# EAGLE design eTapper1main23 (EAGLE 8.2.2)
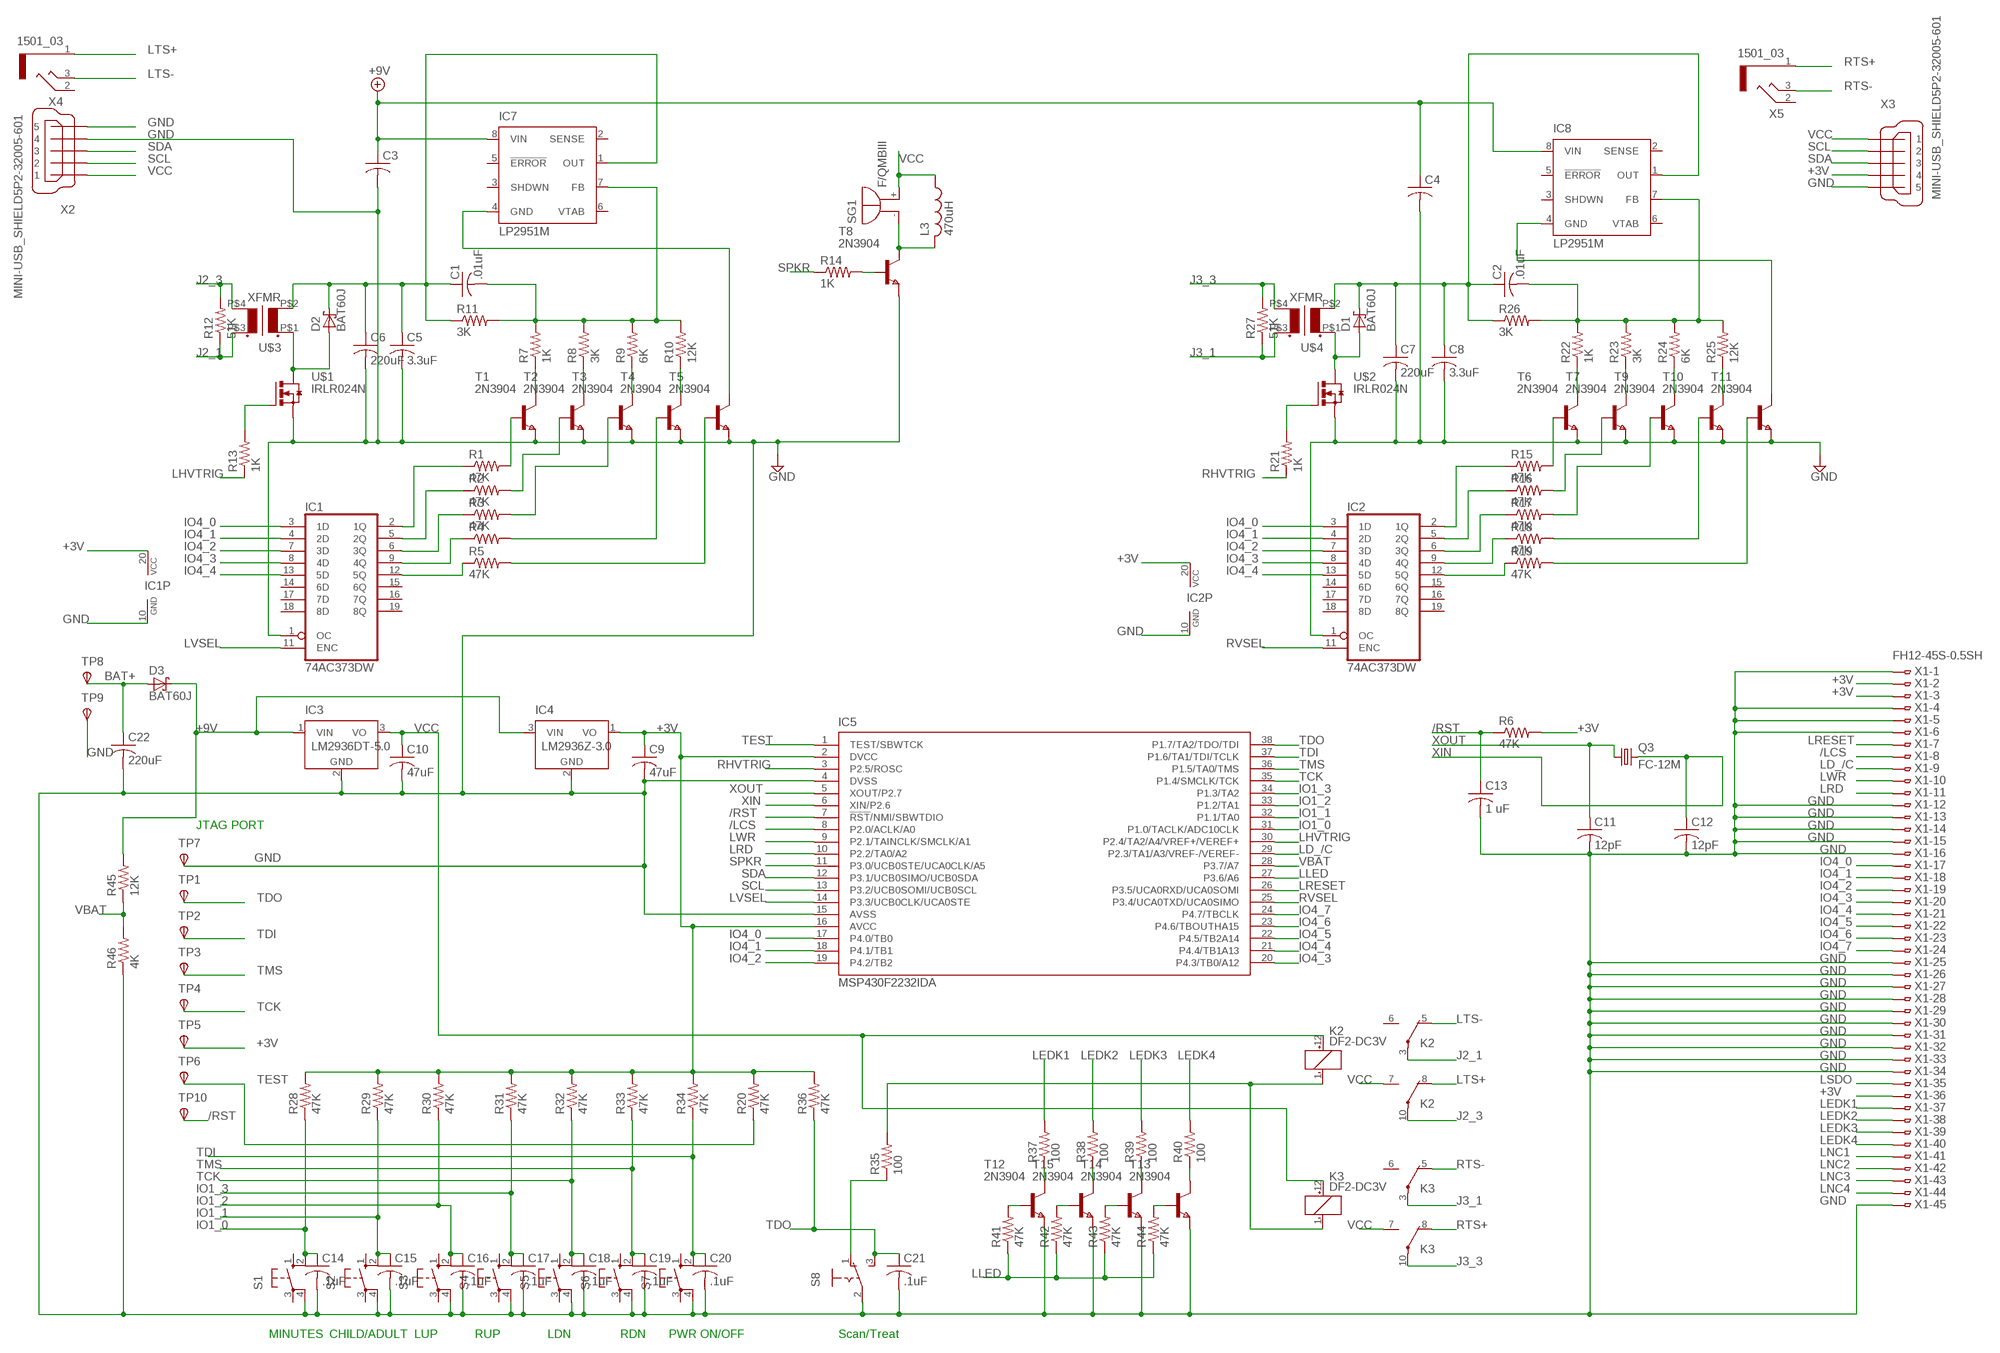
[diagram p0: schematic, sheet 1]

## Parts
C1  .01uF  C-USC0805  [C0805]
C2  .01uF  C-USC0805  [C0805]
C3  C-USC0805  [C0805]
C4  C-USC0805  [C0805]
C5  3.3uF  C-USC0805  [C0805]
C6  220uF  C-USC0805  [C0805]
C7  220uF  C-USC0805  [C0805]
C8  3.3uF  C-USC0805  [C0805]
C9  47uF  C-USC0805  [C0805]
C10  47uF  C-USC0805  [C0805]
C11  12pF  C-USC0805  [C0805]
C12  12pF  C-USC0805  [C0805]
C13  1 uF  C-USC0805  [C0805]
C14  .1uF  C-USC0805  [C0805]
C15  .1uF  C-USC0805  [C0805]
C16  .1uF  C-USC0805  [C0805]
C17  .1uF  C-USC0805  [C0805]
C18  .1uF  C-USC0805  [C0805]
C19  .1uF  C-USC0805  [C0805]
C20  .1uF  C-USC0805  [C0805]
C21  .1uF  C-USC0805  [C0805]
C22  220uF  C-USC0805  [C0805]
D1  BAT60J  [SOD323_ST]
D2  BAT60J  [SOD323_ST]
D3  BAT60J  [SOD323_ST]
IC1  74AC373DW  [SO20W]
IC2  74AC373DW  [SO20W]
IC3  LM2936DT-5.0  [TO252]
IC4  LM2936Z-3.0  [TO92]
IC5  MSP430F2232IDA  [TSSOP38_R-PDSO-G38-DA]
IC7  LP2951M  [SO08]
IC8  LP2951M  [SO08]
K2  DF2-DC3V  [DF2]
K3  DF2-DC3V  [DF2]
L3  470uH  L-USL2825P  [L2825P]
Q3  FC-12M  [FC-12M]
R1  47K  R-US_R0402  [R0402]
R2  47K  R-US_R0402  [R0402]
R3  47K  R-US_R0402  [R0402]
R4  R-US_R0402  [R0402]
R5  47K  R-US_R0402  [R0402]
R6  47K  R-US_R0402  [R0402]
R7  1K  R-US_R0402  [R0402]
R8  3K  R-US_R0402  [R0402]
R9  6K  R-US_R0402  [R0402]
R10  12K  R-US_R0402  [R0402]
R11  3K  R-US_R0402  [R0402]
R12  51K  R-US_R0402  [R0402]
R13  1K  R-US_R0402  [R0402]
R14  1K  R-US_R0402  [R0402]
R15  47K  R-US_R0402  [R0402]
R16  47K  R-US_R0402  [R0402]
R17  47K  R-US_R0402  [R0402]
R18  47K  R-US_R0402  [R0402]
R19  47K  R-US_R0402  [R0402]
R20  47K  R-US_R0402  [R0402]
R21  1K  R-US_R0402  [R0402]
R22  1K  R-US_R0402  [R0402]
R23  3K  R-US_R0402  [R0402]
R24  6K  R-US_R0402  [R0402]
R25  12K  R-US_R0402  [R0402]
R26  3K  R-US_R0402  [R0402]
R27  51K  R-US_R0402  [R0402]
R28  47K  R-US_R0402  [R0402]
R29  47K  R-US_R0402  [R0402]
R30  47K  R-US_R0402  [R0402]
R31  47K  R-US_R0402  [R0402]
R32  47K  R-US_R0402  [R0402]
R33  47K  R-US_R0402  [R0402]
R34  47K  R-US_R0402  [R0402]
R35  100  R-US_R0402  [R0402]
R36  47K  R-US_R0402  [R0402]
R37  100  R-US_R0402  [R0402]
R38  100  R-US_R0402  [R0402]
R39  100  R-US_R0402  [R0402]
R40  100  R-US_R0402  [R0402]
R41  47K  R-US_R0402  [R0402]
R42  47K  R-US_R0402  [R0402]
R43  47K  R-US_R0402  [R0402]
R44  47K  R-US_R0402  [R0402]
R45  12K  R-US_R0402  [R0402]
R46  4K  R-US_R0402  [R0402]
S1  10-XX  [B3F-10XX]
S2  10-XX  [B3F-10XX]
S3  10-XX  [B3F-10XX]
S4  10-XX  [B3F-10XX]
S5  10-XX  [B3F-10XX]
S6  10-XX  [B3F-10XX]
S7  10-XX  [B3F-10XX]
S8  M251  [M251]
SG1  F/QMBIII  [F/QMBIII]
T1  2N3904  NPNSOT23  [SOT-23]
T2  2N3904  NPNSOT23  [SOT-23]
T3  2N3904  NPNSOT23  [SOT-23]
T4  2N3904  NPNSOT23  [SOT-23]
T5  2N3904  NPNSOT23  [SOT-23]
T6  2N3904  NPNSOT23  [SOT-23]
T7  2N3904  NPNSOT23  [SOT-23]
T8  2N3904  NPNSOT23  [SOT-23]
T9  2N3904  NPNSOT23  [SOT-23]
T10  2N3904  NPNSOT23  [SOT-23]
T11  2N3904  NPNSOT23  [SOT-23]
T12  2N3904  NPNSOT23  [SOT-23]
T13  2N3904  NPNSOT23  [SOT-23]
T14  2N3904  NPNSOT23  [SOT-23]
T15  2N3904  NPNSOT23  [SOT-23]
TP1  TPSTP06R  [TP06R]
TP2  TPSTP06R  [TP06R]
TP3  TPSTP06R  [TP06R]
TP4  TPSTP06R  [TP06R]
TP5  TPSTP06R  [TP06R]
TP6  TPSTP06R  [TP06R]
TP7  TPSTP06R  [TP06R]
TP8  TPSTP06R  [TP06R]
TP9  TPSTP06R  [TP06R]
TP10  TPSTP06R  [TP06R]
U$1  IRLR024N  [D-PAK_TO252AA]
U$2  IRLR024N  [D-PAK_TO252AA]
U$3  XFMR  [XFMR]
U$4  XFMR  [XFMR]
X1  FH12-45S-0.5SH  [FH12-45S-0.5SH]
X2  MINI-USB_SHIELD5P2-32005-601  [32005-601]
X3  MINI-USB_SHIELD5P2-32005-601  [32005-601]
X4  1501_03  [1501_03]
X5  1501_03  [1501_03]

## Nets
+3V: C9.1 IC1.20(VCC) IC2.20(VCC) IC4.1(VO) IC5.2(DVCC) IC5.16(AVCC) R6.2 R20.2 R28.2 R29.2 R30.2 R31.2 R32.2 R33.2 R34.2 R36.2 TP5.TP(PP) X1.2 X1.3 X1.36 X3.4
+9V: C3.1 C4.1 D3.C IC3.1(VIN) IC4.3(VIN) IC7.8(VIN) IC8.8(VIN) R45.2
/LCS: IC5.8(P2.0/ACLK/A0) X1.8
/RST: C13.1 IC5.7(!RST!/NMI/SBWTDIO) R6.1 TP10.TP(PP)
BAT+: C22.1 D3.A TP8.TP(PP)
GND: C3.2 C4.2 C5.2 C6.2 C7.2 C8.2 C9.2 C10.2 C11.2 C12.2 C13.2 C14.2 C15.2 C16.2 C17.2 C18.2 C19.2 C20.2 C21.2 C22.2 IC1.1(OC) IC1.10(GND) IC2.1(OC) IC2.10(GND) IC3.2(GND) IC4.2(GND) IC5.4(DVSS) IC5.15(AVSS) R46.1 S1.4(P1) S2.4(P1) S3.4(P1) S4.4(P1) S5.4(P1) S6.4(P1) S7.4(P1) S8.2(P) T1.2(E) T2.2(E) T3.2(E) T4.2(E) T5.2(E) T6.2(E) T7.2(E) T8.2(E) T9.2(E) T10.2(E) T11.2(E) T12.2(E) T13.2(E) T14.2(E) T15.2(E) TP7.TP(PP) TP9.TP(PP) U$1.3(S) U$2.3(S) X1.1 X1.4 X1.5 X1.6 X1.12 X1.13 X1.14 X1.15 X1.16 X1.25 X1.26 X1.27 X1.28 X1.29 X1.30 X1.31 X1.32 X1.33 X1.34 X1.45 X2.4 X2.5 X3.5
IO1_0: C14.1 IC5.31(P1.0/TACLK/ADC10CLK) R28.1 S1.2(S1)
IO1_1: C15.1 IC5.32(P1.1/TA0) R29.1 S2.2(S1)
IO1_2: C16.1 IC5.33(P1.2/TA1) R30.1 S3.2(S1)
IO1_3: C17.1 IC5.34(P1.3/TA2) R31.1 S4.2(S1)
IO4_0: IC1.3(1D) IC2.3(1D) IC5.17(P4.0/TB0) X1.17
IO4_1: IC1.4(2D) IC2.4(2D) IC5.18(P4.1/TB1) X1.18
IO4_2: IC1.7(3D) IC2.7(3D) IC5.19(P4.2/TB2) X1.19
IO4_3: IC1.8(4D) IC2.8(4D) IC5.20(P4.3/TB0/A12) X1.20
IO4_4: IC1.13(5D) IC2.13(5D) IC5.21(P4.4/TB1A13) X1.21
IO4_5: IC5.22(P4.5/TB2A14) X1.22
IO4_6: IC5.23(P4.6/TBOUTHA15) X1.23
IO4_7: IC5.24(P4.7/TBCLK) X1.24
J2_1: K2.3(2:P) R12.1 U$3.P$3(S1)
J2_3: K2.10(3:P) R12.2 U$3.P$4(S2)
J3_1: K3.3(2:P) R27.1 U$4.P$3(S1)
J3_3: K3.10(3:P) R27.2 U$4.P$4(S2)
LD_/C: IC5.29(P2.3/TA1/A3/VREF-/VEREF-) X1.9
LEDK1: R37.2 X1.37
LEDK2: R38.2 X1.38
LEDK3: R39.2 X1.39
LEDK4: R40.2 X1.40
LHVTRIG: IC5.30(P2.4/TA2/A4/VREF+/VEREF+) R13.1
LLED: IC5.27(P3.6/A6) R41.1 R42.1 R43.1 R44.1
LNC1: X1.41
LNC2: X1.42
LNC3: X1.43
LNC4: X1.44
LRD: IC5.10(P2.2/TA0/A2) X1.11
LRESET: IC5.26(P3.5/UCA0RXD/UCA0SOMI) X1.7
LSDO: X1.35
LTS+: K2.8(3:O) X4.1
LTS-: K2.5(2:O) X4.3
LVSEL: IC1.11(ENC) IC5.14(P3.3/UCB0CLK/UCA0STE)
LWR: IC5.9(P2.1/TAINCLK/SMCLK/A1) X1.10
N$1: IC1.2(1Q) R1.1
N$2: IC1.5(2Q) R2.1
N$3: IC1.6(3Q) R3.1
N$4: IC1.9(4Q) R4.1
N$5: IC1.12(5Q) R5.1
N$6: L3.2 SG1.-(+) T8.1(C)
N$7: R4.2 T4.3(B)
N$8: R5.2 T5.3(B)
N$9: D2.A U$1.4(D) U$3.P$1(P1)
N$10: R7.1 T1.1(C)
N$11: R8.1 T2.1(C)
N$12: R9.1 T3.1(C)
N$13: R1.2 T1.3(B)
N$14: R2.2 T2.3(B)
N$15: R3.2 T3.3(B)
N$16: R10.1 T4.1(C)
N$17: C1.2 IC7.7(FB) R7.2 R8.2 R9.2 R10.2 R11.2
N$18: C1.1 C5.1 C6.1 D2.C IC7.1(OUT) R11.1 U$3.P$2(P2)
N$19: D1.A U$2.4(D) U$4.P$1(P1)
N$20: IC2.2(1Q) R15.1
N$21: R13.2 U$1.1(G)
N$22: R14.2 T8.3(B)
N$23: R35.1 S8.1(O)
N$24: IC2.5(2Q) R16.1
N$25: IC2.6(3Q) R17.1
N$26: IC2.9(4Q) R18.1
N$27: IC2.12(5Q) R19.1
N$28: R44.2 T13.3(B)
N$29: R15.2 T6.3(B)
N$30: R16.2 T7.3(B)
N$31: R17.2 T9.3(B)
N$32: R18.2 T10.3(B)
N$33: R19.2 T11.3(B)
N$34: K2.1(1:-) K3.1(1:-) R35.2
N$35: R22.1 T6.1(C)
N$36: R23.1 T7.1(C)
N$37: R24.1 T9.1(C)
N$38: R25.1 T10.1(C)
N$39: C2.2 IC8.7(FB) R22.2 R23.2 R24.2 R25.2 R26.2
N$40: C2.1 C7.1 C8.1 D1.C IC8.1(OUT) R26.1 U$4.P$2(P2)
N$41: R37.1 T12.1(C)
N$42: R21.2 U$2.1(G)
N$43: R38.1 T15.1(C)
N$44: R39.1 T14.1(C)
N$45: IC7.4(GND) T5.1(C)
N$46: R40.1 T13.1(C)
N$47: IC8.4(GND) T11.1(C)
N$48: R43.2 T14.3(B)
N$49: R41.2 T12.3(B)
N$50: R42.2 T15.3(B)
RHVTRIG: IC5.3(P2.5/ROSC) R21.1
RTS+: K3.8(3:O) X5.1
RTS-: K3.5(2:O) X5.3
RVSEL: IC2.11(ENC) IC5.25(P3.4/UCA0TXD/UCA0SIMO)
SCL: IC5.13(P3.2/UCB0SOMI/UCB0SCL) X2.2 X3.2
SDA: IC5.12(P3.1/UCB0SIMO/UCB0SDA) X2.3 X3.3
SPKR: IC5.11(P3.0/UCB0STE/UCA0CLK/A5) R14.1
TCK: C18.1 IC5.35(P1.4/SMCLK/TCK) R32.1 S5.2(S1) TP4.TP(PP)
TDI: C20.1 IC5.37(P1.6/TA1/TDI/TCLK) R34.1 S7.2(S1) TP2.TP(PP)
TDO: C21.1 IC5.38(P1.7/TA2/TDO/TDI) R36.1 S8.3(S) TP1.TP(PP)
TEST: IC5.1(TEST/SBWTCK) R20.1 TP6.TP(PP)
TMS: C19.1 IC5.36(P1.5/TA0/TMS) R33.1 S6.2(S1) TP3.TP(PP)
VBAT: IC5.28(P3.7/A7) R45.1 R46.2
VCC: C10.1 IC3.3(VO) K2.7(3:S) K2.12(1:+) K3.7(3:S) K3.12(1:+) L3.1 SG1.+(-) X2.1 X3.1
XIN: C12.1 IC5.6(XIN/P2.6) Q3.2
XOUT: C11.1 IC5.5(XOUT/P2.7) Q3.1
Unconnected: IC1.14(6D) IC1.15(6Q) IC1.16(7Q) IC1.17(7D) IC1.18(8D) IC1.19(8Q) IC2.14(6D) IC2.15(6Q) IC2.16(7Q) IC2.17(7D) IC2.18(8D) IC2.19(8Q) IC7.2(SENSE) IC7.3(SHDWN) IC7.5(!ERROR) IC7.6(VTAB) IC8.2(SENSE) IC8.3(SHDWN) IC8.5(!ERROR) IC8.6(VTAB) K2.6(2:S) K3.6(2:S) S1.1(S) S1.3(P) S2.1(S) S2.3(P) S3.1(S) S3.3(P) S4.1(S) S4.3(P) S5.1(S) S5.3(P) S6.1(S) S6.3(P) S7.1(S) S7.3(P) X2.M1(S1) X2.M2(S2) X3.M1(S1) X3.M2(S2) X4.2 X5.2

## Notes on the sheet
- JTAG PORT
- MINUTES | CHILD/ADULT | LUP | RUP | LDN | RDN | PWR ON/OFF | Scan/Treat

## Library data of the parts
C1-C22 = rcl:C-US: CAPACITOR, American symbol
D1-D3 = diode:BAT60J: Schottky barrier diode Source: www.st.com, BAT60J.pdf
IC1 IC2 = 74xx-eu:74*373: Octal D type transparent LATCH, edge triggered
IC3 = national-semiconductor:LM2936?*: Ultra-Low Quiescent Current LDO Voltage Regulator Source: Data sheet <http://www.national.com/ds/LM/LM2936.pdf>; MF: NATIONAL SEMICONDUCTOR; MPN: LM2936DT-5.0/NOPB; OC_FARNELL: 1286864; OC_NEWARK: 41K4501
IC4 = national-semiconductor:LM2936?*: Ultra-Low Quiescent Current LDO Voltage Regulator Source: Data sheet <http://www.national.com/ds/LM/LM2936.pdf>; MF: NATIONAL SEMICONDUCTOR; MPN: LM2936Z-3.0/NOPB; OC_FARNELL: 1312709; OC_NEWARK: 41K4531
IC5 = texas:MSP430F22*2IDA: MIXED SIGNAL MICROCONTROLLER Source: http://focus.ti.com/lit/ds/symlink/msp430f2274.pdf; MPN: MSP430F2232IDA; OC_FARNELL: 1610178; OC_NEWARK: 28M6312
IC7 IC8 = national-semiconductor:LP2951: Adjustable Micropower Voltage Regulator Source: http://www.national.com/ds/LP/LP2950.pdf; MF: FAIRCHILD SEMICONDUCTOR; MPN: LP2951CM; OC_FARNELL: 9488561; OC_NEWARK: 78K6014
K2 K3 = relay:DF2-?DC*: HIGHLY SENSITIVE DIP MINIATURE RELAY NAiS Single side stable / 1 coil latching Source: http://www.mew-europe.com/.. en_ds_61002_0000.pdf; OC_FARNELL: unknown; OC_NEWARK: unknown
L3 = rcl:L-US: INDUCTOR, American symbol
Q3 = crystal:FC-12M: kHz RANGE CRYSTAL UNIT LOW PROFILE SMD Source: Epson Toyocom FC-12M.pdf
R1-R46 = resistor:R-US_: RESISTOR, American symbol
S1-S7 = switch-omron:10-XX: OMRON SWITCH; MPN: B3F-1000; OC_FARNELL: 176432; OC_NEWARK: 36M3542
S8 = switch:M251: SLIDING SWITCH Mors, distributor Buerklin, 11G702
SG1 = buzzer:F/QMBIII: BUZZER Source: Buerklin; OC_FARNELL: unknown; OC_NEWARK: unknown
T1-T15 = zetex:NPNSOT23: NPN TRANSISTOR; MPN: DSS20201L-7; OC_FARNELL: 1710688; OC_NEWARK: 25R4555
TP1-TP10 = testpad:TPS: TEST PIN
U$1 U$2 = IRLR024N:IRLR024N: IRLR024N HEXFET Power Mosfet N channel Infeneon Technology TO-251AA IPAK
U$3 U$4 = XFMR:XFMR: Transformer 1"X1" 0.4"X0.4" hole separation for e_tapper
X1 = con-hirose:FH12-45S-0.5S: 0.5mm Pitch Connectors For FPC/FFC Source: Data sheet <http://www.hirose.co.jp/cataloge_hp/e58605370.pdf>; OC_FARNELL: unknown; OC_NEWARK: unknown
X2 X3 = con-cypressindustries:MINI-USB_SHIELD5P2-: MINI USB-B R/A DIP 5pol. Source: www.cypressindustries.com; OC_FARNELL: unknown; OC_NEWARK: unknown
X4 X5 = con-lumberg:1501_03: Klinkensteckverbinder nach JISC 6560, 2,5 mm Jack connectors according to JISC 6560, 2.5 mm Source: http://www.lumberg.com/Produkte/PDFs/1501_03.pdf; OC_FARNELL: 1200127; OC_NEWARK: unknown

## Module LP2951
Ports: 

### Library data of the parts

## Board
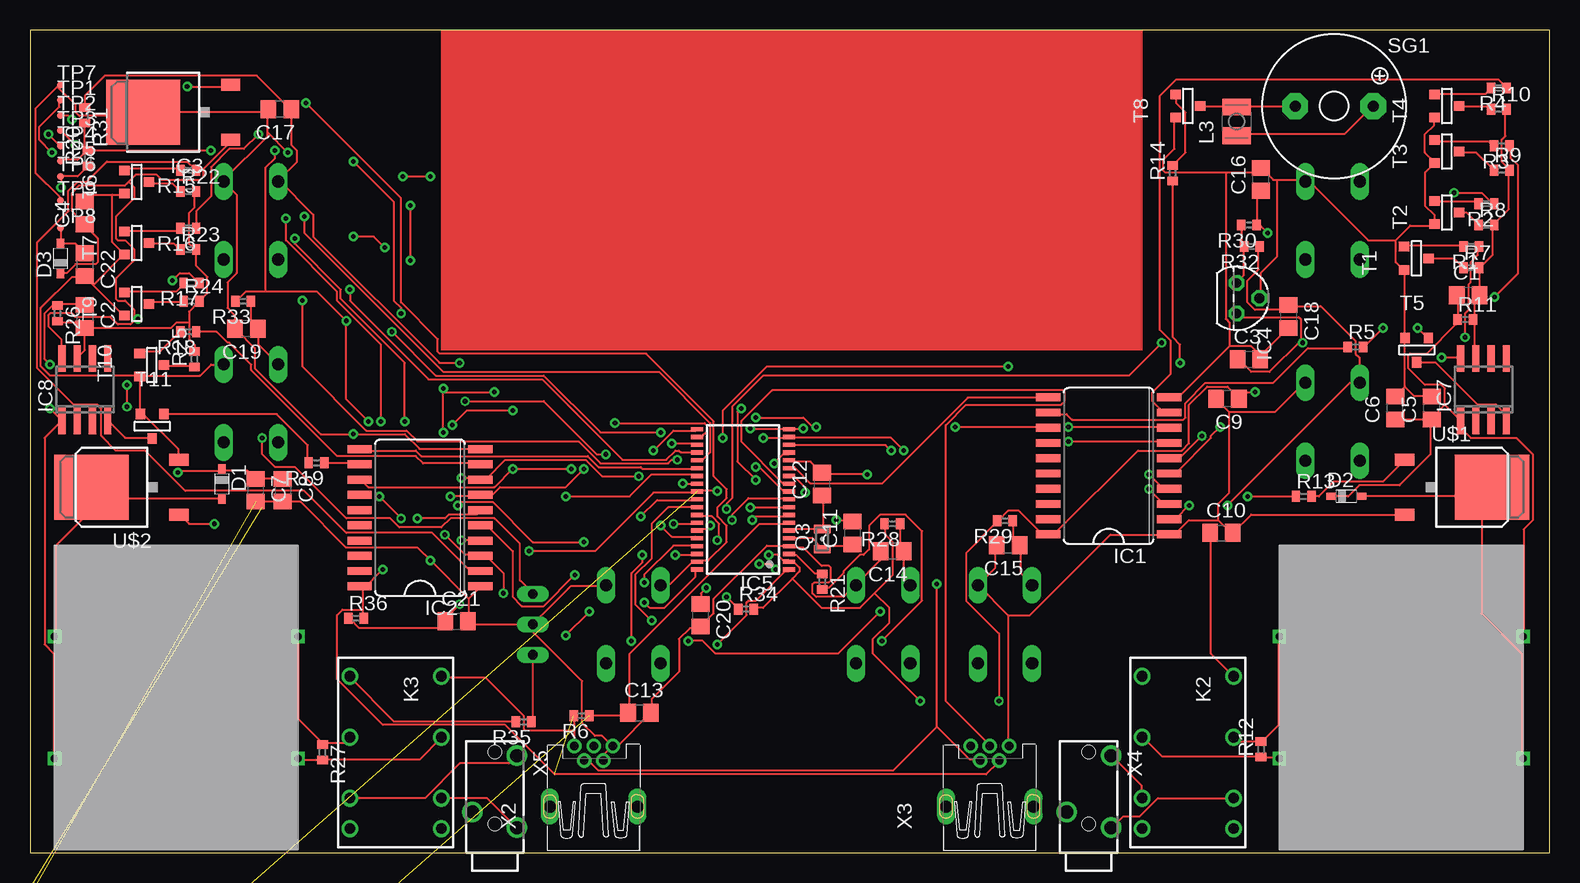
[diagram p1: board, top side]
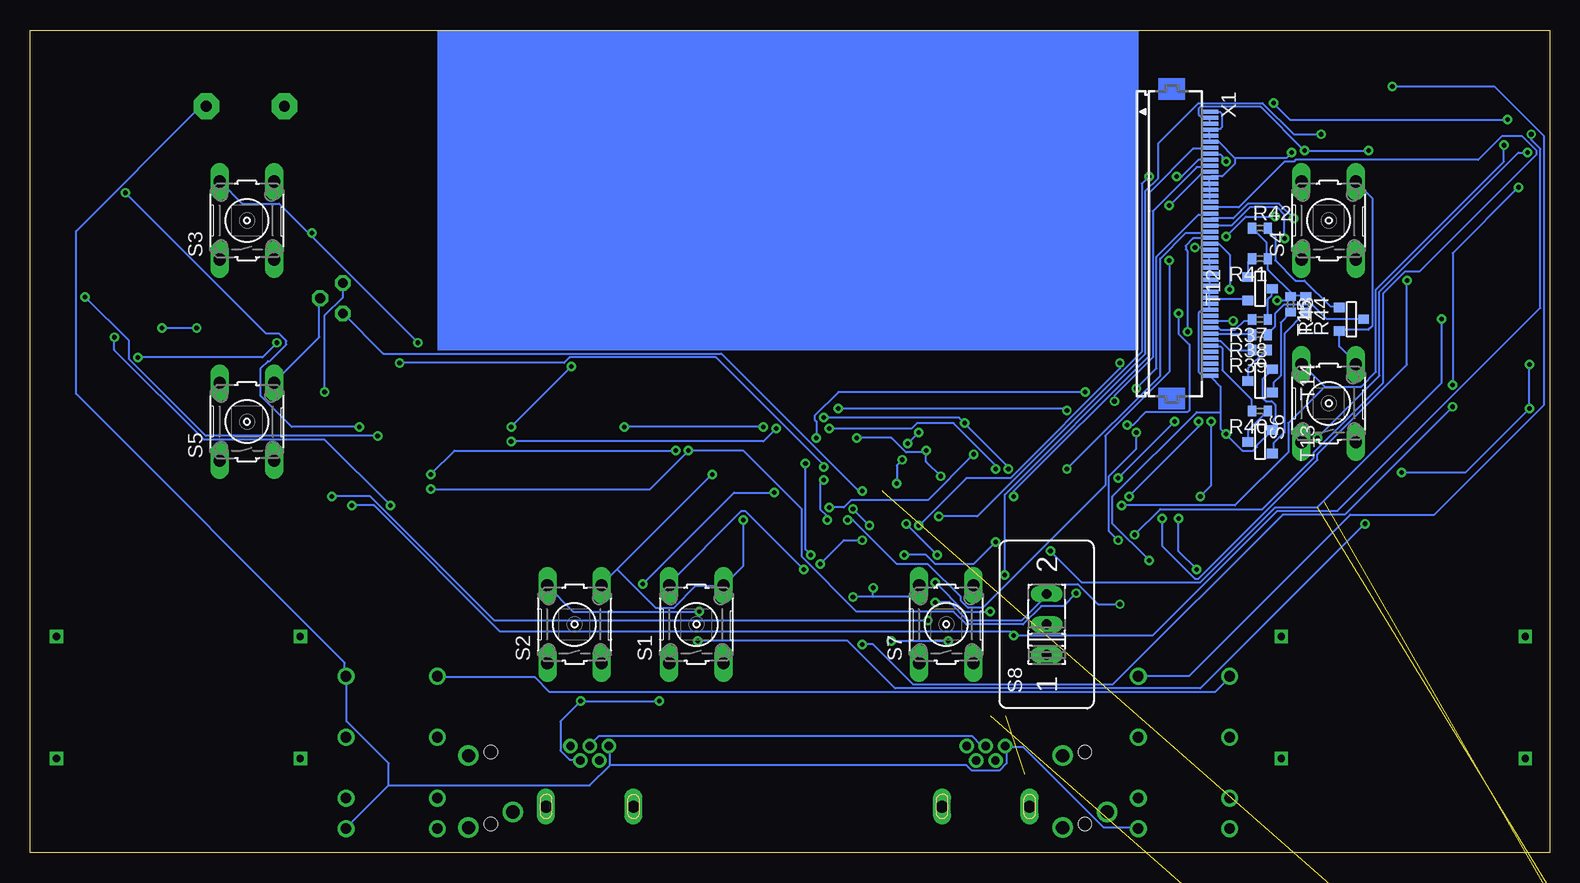
[diagram p2: board, bottom side, seen from below]

Size 126.67 x 68.57 mm. Coordinates in mm from the lower left corner, seen from the top.
Outline: 0,0 126.67,0 126.67,68.57 0,68.57 0,0
Copper layers (1*16): Top 0.035mm / dielectric 1.5mm / Bottom 0.035mm
Design rules "default *": minimum track width 6mil, minimum drill 15mil, track to track 6mil, track to pad 6mil, pad to pad 6mil, via to via 6mil, smd to smd 6mil, copper to edge 10mil, drill to drill 10mil, minimum pad ring 10mil, minimum via ring 8mil, stop-mask expansion 4mil, vias tented up to drill 0mil, thermal gap 15mil

### Footprints (pad centres in the part's own frame; a part is rotated, then mirrored left to right if it is on the bottom)
C0805 = smd 1.3 x 1.5: 1 -0.95,0; 2 0.95,0
SOD323_ST = smd 0.8 x 0.6: A 1.25,0; C -1.25,0
SO20W = smd 0.66 x 2.032: 1 -5.715,-5.029; 2 -4.445,-5.029; 3 -3.175,-5.029; 4 -1.905,-5.029; 5 -0.635,-5.029; 6 0.635,-5.029; 7 1.905,-5.029; 8 3.175,-5.029; 9 4.445,-5.029; 10 5.715,-5.029; 11 5.715,5.029; 12 4.445,5.029; 13 3.175,5.029; 14 1.905,5.029; 15 0.635,5.029; 16 -0.635,5.029; 17 -1.905,5.029; 18 -3.175,5.029; 19 -4.445,5.029; 20 -5.715,5.029
TO252 = smd 1 x 1.6: 1 -2.28,-4.8; 3 2.28,-4.8 | smd 5.4 x 6.2: 2 0,2.5
TO92 = drill 0.813 pad 1.27 octagon: 1 -1.27,0; 2 0,1.905; 3 1.27,0
TSSOP38_R-PDSO-G38-DA = smd 0.35 x 1: 1 -5.85,-3.85; 2 -5.2,-3.85; 3 -4.55,-3.85; 4 -3.9,-3.85; 5 -3.25,-3.85; 6 -2.6,-3.85; 7 -1.95,-3.85; 8 -1.3,-3.85; 9 -0.65,-3.85; 10 0,-3.85; 11 0.65,-3.85; 12 1.3,-3.85; 13 1.95,-3.85; 14 2.6,-3.85; 15 3.25,-3.85; 16 3.9,-3.85; 17 4.55,-3.85; 18 5.2,-3.85; 19 5.85,-3.85; 20 5.85,3.85; 21 5.2,3.85; 22 4.55,3.85; 23 3.9,3.85; 24 3.25,3.85; 25 2.6,3.85; 26 1.95,3.85; 27 1.3,3.85; 28 0.65,3.85; 29 0,3.85; 30 -0.65,3.85; 31 -1.3,3.85; 32 -1.95,3.85; 33 -2.6,3.85; 34 -3.25,3.85; 35 -3.9,3.85; 36 -4.55,3.85; 37 -5.2,3.85; 38 -5.85,3.85
SO08 = smd 0.6 x 2.2: 1 -1.905,-2.6; 2 -0.635,-2.6; 3 0.635,-2.6; 4 1.905,-2.6; 5 1.905,2.6; 6 0.635,2.6; 7 -0.635,2.6; 8 -1.905,2.6
DF2 = drill 0.9: 1 -6.35,-3.81; 3 -1.27,-3.81; 5 3.81,-3.81; 6 6.35,-3.81; 7 6.35,3.81; 8 3.81,3.81; 10 -1.27,3.81; 12 -6.35,3.81
L2825P = smd 1.4 x 2.4: 1 -1.2,0; 2 1.2,0
FC-12M = smd 0.7 x 1.4: 1 -0.85,0; 2 0.85,0
R0402 = smd 0.7 x 0.9: 1 -0.65,0; 2 0.65,0
B3F-10XX = drill 1.016 long: 1 -3.251,2.261; 2 3.251,2.261; 3 -3.251,-2.261; 4 3.251,-2.261
M251 = drill 0.813 long: 1 -2.54,0; 2 0,0; 3 2.54,0
F/QMBIII = drill 0.914 pad 2.159 octagon: + 3.251,0; - -3.251,0
SOT-23 = smd 0.787 x 0.889: 1 0.025,-1.016; 2 -0.94,1.016; 3 0.991,1.016
TP06R = smd 0.6 x 0.6: TP 0,0
D-PAK_TO252AA = smd 1 x 1.6: 1 -2.28,-4.8; 3 2.28,-4.8 | smd 5.4 x 6.2: 4 0,2.5
XFMR = drill 0.6 square: P$1 -10.16,5.08; P$2 -10.16,-5.08; P$3 10.16,5.08; P$4 10.16,-5.08
FH12-45S-0.5SH = smd 0.3 x 1.3: 1 -13,3.25; 2 -12.5,3.25; 3 -12,3.25; 4 -11.5,3.25; 5 -11,3.25; 6 -10.5,3.25; 7 -10,3.25; 8 -9.5,3.25; 9 -9,3.25; 10 -8.5,3.25; 11 -8,3.25; 12 -7.5,3.25; 13 -7,3.25; 14 -6.5,3.25; 15 -6,3.25; 16 -5.5,3.25; 17 -5,3.25; 18 -4.5,3.25; 19 -4,3.25; 20 -3.5,3.25; 21 -3,3.25; 22 -2.5,3.25; 23 -2,3.25; 24 -1.5,3.25; 25 -1,3.25; 26 -0.5,3.25; 27 0,3.25; 28 0.5,3.25; 29 1,3.25; 30 1.5,3.25; 31 2,3.25; 32 2.5,3.25; 33 3,3.25; 34 3.5,3.25; 35 4,3.25; 36 4.5,3.25; 37 5,3.25; 38 5.5,3.25; 39 6,3.25; 40 6.5,3.25; 41 7,3.25; 42 7.5,3.25; 43 8,3.25; 44 8.5,3.25; 45 9,3.25
32005-601 = drill 0.7 pad 1.016: 1 2.825,1.6; 2 1.625,0.8; 3 2.825,0; 4 1.625,-0.8; 5 2.825,-1.6 | drill 1 pad 1.422 long: M1 -2.225,3.65; M2 -2.225,-3.65
1501_03 = drill 1.1 pad 1.7: 1 -1.85,0.3; 2 1.85,-1; 3 -1.85,-5.7 | hole 1.1: 0,0; 0,-6

### Placement (x,y rotation side)
C1  119.89,46.48 0 top
C2  4.57,44.7 270 top
C3  101.6,41.15 0 top
C4  4.57,53.34 90 top
C5  116.84,37.08 90 top
C6  113.79,37.08 90 top
C7  18.8,30.23 270 top
C8  21.08,30.23 270 top
C9  99.82,37.85 180 top
C10  99.31,26.67 0 top
C11  68.58,26.67 90 top
C12  66.04,30.73 90 top
C13  50.8,11.68 0 top
C14  71.88,25.15 180 top
C15  81.53,25.65 180 top
C16  102.62,56.13 90 top
C17  20.83,61.98 180 top
C18  104.9,44.7 270 top
C19  18.03,43.69 180 top
C20  55.88,19.81 270 top
C21  35.56,19.3 0 top
C22  4.57,49.02 270 top
D1  16,30.73 270 top
D2  109.73,29.72 0 top
D3  2.54,49.53 90 top
DRILEGEND  [DRILEGEND]  -5.21,-10.2 0 top  (outside the outline)
IC1  89.92,32.26 90 top
IC2  32.51,27.94 90 top
IC3  11.94,61.72 90 top
IC4  100.58,46.23 270 top
IC5  59.44,29.46 90 top
IC7  121.16,38.61 0 top
IC8  4.57,38.61 0 top
K2  96.52,8.38 270 top
K3  30.48,8.38 270 top
L3  100.58,60.96 90 top
Q3  66.04,26.16 90 top
R1  120.14,50.55 180 top
R2  121.41,54.1 180 top
R3  122.68,58.93 180 top
R4  122.43,63.75 180 top
R5  110.49,42.16 0 top
R6  45.97,11.43 180 top
R7  120.14,48.77 0 top
R8  121.41,52.32 0 top
R9  122.68,56.9 0 top
R10  122.43,61.98 0 top
R11  119.63,44.45 0 top
R12  102.62,8.64 90 top
R13  106.17,29.72 0 top
R14  95.25,56.64 90 top
R15  13.21,56.9 180 top
R16  13.21,52.07 180 top
R17  13.46,47.5 180 top
R18  13.21,43.43 180 top
R19  23.88,32.51 180 top
R20  4.83,57.91 90 top
R21  66.04,22.61 270 top
R22  13.21,55.12 0 top
R23  13.21,50.29 0 top
R24  13.46,45.97 0 top
R25  13.72,41.15 90 top
R26  2.29,44.96 270 top
R27  24.38,8.38 270 top
R28  71.88,27.43 180 top
R29  81.28,27.69 180 top
R30  101.6,52.32 180 top
R31  4.57,61.47 270 top
R32  101.85,50.55 180 top
R33  17.78,45.97 180 top
R34  59.69,20.32 0 top
R35  41.15,10.92 180 top
R36  27.18,19.56 0 top
R37  24.13,44.45 180 bottom
R38  24.13,43.18 180 bottom
R39  24.13,41.91 180 bottom
R40  24.13,36.83 180 bottom
R41  24.13,49.53 180 bottom
R42  24.13,52.07 0 bottom
R43  21.59,45.72 270 bottom
R44  20.32,45.72 270 bottom
R45  -22.86,-39.37 0 top  (outside the outline)
R46  -22.86,-44.45 0 top  (outside the outline)
S1  71.12,19.05 90 bottom
S2  81.28,19.05 90 bottom
S3  108.58,52.7 90 bottom
S4  18.41,52.7 90 bottom
S5  108.58,35.94 90 bottom
S6  18.41,37.47 90 bottom
S7  50.29,19.05 90 bottom
S8  41.91,19.05 90 bottom
SG1  108.71,62.23 0 top
T1  115.57,49.53 90 top
T2  118.11,53.34 90 top
T3  118.11,58.42 90 top
T4  118.11,62.23 90 top
T5  115.57,41.91 0 top
T6  8.89,55.88 90 top
T7  8.89,50.8 90 top
T8  96.52,62.23 90 top
T9  8.89,45.72 90 top
T10  10.16,40.64 90 top
T11  10.16,35.56 0 top
T12  24.13,46.99 90 bottom
T13  24.13,34.29 270 bottom
T14  24.13,39.37 270 bottom
T15  16.51,44.45 90 bottom
TP1  2.54,62.74 0 top
TP2  2.54,61.47 0 top
TP3  2.54,60.2 0 top
TP4  2.54,58.93 0 top
TP5  2.54,57.66 0 top
TP6  2.54,56.39 0 top
TP7  2.54,64.01 0 top
TP8  2.54,52.07 0 top
TP9  2.54,54.36 0 top
TP10  -22.86,-49.53 0 top  (outside the outline)
U$1  119.38,30.48 270 top
U$2  7.62,30.48 90 top
U$3  114.3,12.95 180 top
U$4  12.19,12.95 0 top
X1  31.5,48.77 270 bottom
X2  46.99,6.1 90 top
X3  80.01,6.1 90 top
X4  88.27,2.41 180 top
X5  38.73,2.41 180 top

### Tracks (layer width: path | path; a pad name or v marks a point on that pad's centre or on a via)
+3V  (via drill 0.38)  (1 unrouted)
  Top 0.152: TP5.TP 2.59,57.76 3.96,57.76 4.72,58.52 R20.2 | R31.2 4.57,58.83 4.72,58.67 R20.2 | 19.66,46.79 23.93,46.79 v26.36,44.35 26.36,37.8 v28.19,35.97 | 19.66,46.79 17.98,46.79 17.22,46.02 R33.2 | v20.42,58.52 20.42,57.91 19.66,57.15 19.66,46.79 | v15.09,58.52 4.88,58.52 R20.2 | 63.55,22.86 64.16,23.47 64.16,23.77 63.7,24.23 63.4,24.23 IC5.2 63.25,24.38 62.79,24.38 62.33,24.84 v61.57,24.84 | 63.55,22.86 61.11,20.42 60.35,20.42 R34.2 | 70.41,21.64 69.19,20.42 65.99,20.42 63.55,22.86 | 70.41,21.64 71.93,23.16 71.93,25.91 71.32,26.52 71.32,27.43 R28.2 | v62.03,32.46 62.79,33.22 63.25,33.22 IC5.16 | R30.2 101.04,52.27 101.04,50.75 101.19,50.6 R32.2 101.19,50.44 101.19,48.16 100.58,47.55 IC4.1 | 27.74,21.95 27.74,20.27 | 27.74,20.27 27.74,19.66 R36.2 | 27.74,21.95 27.58,22.1 IC2.20 27.74,21.95 | 84.89,26.67 84.28,26.67 82.45,28.5 81.53,28.5 80.77,27.74 R29.2 80.62,27.58 78.03,24.99 78.03,21.03 80.77,18.29 v80.77,12.65 | 84.89,26.67 85.5,26.67 92.35,33.53 96.01,33.53 96.62,34.14 96.62,37.34 98.15,38.86 99.82,38.86 100.74,37.95 C9.1 100.89,37.95 101.35,38.41 v102.11,38.41 | 84.89,26.67 IC1.20 | 27.74,20.27 26.06,20.27 25.6,19.81 25.6,14.48 29.41,10.67 39.62,10.67 43.74,6.55 79.7,6.55 80.77,7.62 X3.4 | 70.41,21.64 71.63,20.42 71.63,19.2 70.26,17.83 70.26,16.61 v74.22,12.65 | v30.94,27.89 v29.11,29.72 | 27.74,21.95 v29.41,23.62
  Bottom 0.152: 28.35,61.27 28.35,60.81 X1.3 | v26.36,44.35 28.19,44.35 X1.36 | 28.35,61.27 28.96,61.27 29.26,61.57 29.26,62.03 29.11,62.18 24.08,62.18 v20.42,58.52 v15.09,58.52 | 28.35,61.27 X1.2 | v62.03,32.46 62.03,25.3 v61.57,24.84 | X3.4 80.92,7.77 81.69,7.77 82.45,8.53 82.45,10.97 v80.77,12.65 v74.22,12.65 | IC4.1 100.58,46.33 102.11,44.81 v102.11,38.41 | v28.19,35.97 28.19,30.63 v29.11,29.72 | v30.94,27.89 30.94,25.15 v29.41,23.62
+9V  (via drill 0.38)  (2 unrouted)
  Top 0.152: D3.C 2.59,48.31 3.05,48.31 3.81,49.07 5.49,49.07 5.64,49.23 5.64,51.21 4.57,52.27 C4.1 4.57,52.43 3.5,53.49 3.5,55.02 4.12,55.63 7.92,55.63 8.23,55.93 | 8.23,55.93 8.84,56.54 10.52,56.54 10.97,56.08 14.17,56.08 14.48,56.39 14.48,57 16.61,59.13 16.61,59.44 IC3.1 | 8.69,44.5 8.69,45.26 7.92,46.02 7.32,46.02 7.16,46.18 7.16,47.85 8.69,49.38 8.69,50.29 7.92,51.05 7.32,51.05 7.16,51.21 7.16,53.03 8.69,54.56 8.69,55.47 8.23,55.93 | 8.69,44.5 8.69,44.35 8.38,44.04 7.32,44.04 6.71,44.65 3.81,44.65 3.5,44.96 1.68,44.96 1.52,44.81 1.52,43.89 2.59,42.82 2.59,41.3 IC8.8 | v57.3,30.18 55.63,30.18 | 105.92,42.67 103.33,40.08 101.8,40.08 100.74,41.15 C3.1 | 105.92,42.67 105.92,44.5 105.77,44.65 100.89,44.65 IC4.3 | v117.65,41.3 119.18,41.3 IC7.8 | 105.92,42.67 v106.07,42.52 | v8.99,44.5 8.69,44.5 | v41.6,25.15 47.09,25.15 51.97,30.02 55.47,30.02
  Bottom 0.152: v57.3,30.18 57.61,30.18 69.04,41.6 97.23,41.6 IC4.3 | v117.65,41.3 107.29,41.3 v106.07,42.52 | v8.99,44.5 8.99,39.17 19.36,28.8 22.86,28.8 29.11,22.55 39.01,22.55 v41.6,25.15
/LCS  (via drill 0.38)
  Top 0.152: v60.2,27.74 60.5,28.04 63.25,28.04 IC5.8 | v60.5,31.09 58.98,32.61 58.98,36.73 v59.28,37.03 | v40.23,36.88 36.42,36.88 v35.2,35.66 | v30.94,44.96 30.94,45.41 30.33,46.02 30.33,54.25 v26.98,57.61
  Bottom 0.152: v60.2,27.74 60.2,28.04 60.81,28.65 60.81,30.79 v60.5,31.09 | v59.28,37.03 40.39,37.03 v40.23,36.88 | v35.2,35.66 34.75,35.66 33.68,36.73 30.18,36.73 30.02,36.88 30.02,42.37 30.94,43.28 v30.94,44.96 | v26.98,57.61 27.28,57.91 27.28,58.06 27.43,58.22 28.19,58.22 X1.8
/RST  (1 unrouted)
  Top 0.152: R6.1 49.68,11.43 49.84,11.58 C13.1 49.99,11.73 49.99,16.61 60.81,27.43 63.25,27.43 IC5.7
BAT+
  Top 0.152: TP8.TP 2.59,51.97 2.59,50.9 D3.A 2.59,50.75 3.81,50.75 4.57,49.99 C22.1
GND  (via drill 0.38)  (1 unrouted)
  Top 0.152: 6.86,54.86 5.03,54.86 4.57,54.41 C4.2 | 6.86,54.86 7.77,54.86 T6.2 | 4.57,48.01 5.18,47.4 | 5.18,47.4 7.77,44.81 T9.2 | 5.18,47.4 5.33,47.4 7.77,49.84 T7.2 7.77,49.99 6.86,50.9 6.86,54.86 | U$2.3 12.34,32.77 12.34,33.68 9.45,36.58 T11.2 9.14,36.58 T10.2 9.14,39.78 | 9.14,39.78 14.17,39.78 15.09,40.69 16.15,40.69 S6.4 | 4.57,48.01 3.5,48.01 0.91,45.41 0.91,40.54 1.68,39.78 9.14,39.78 | 4.57,48.01 C22.2 | 2.29,63.86 2.44,64.01 TP7.TP 2.29,63.86 | 2.29,63.86 0.46,62.03 0.46,56.69 2.44,54.71 2.44,54.41 TP9.TP | 2.29,63.86 3.81,62.33 3.81,61.72 4.12,61.42 8.99,61.42 9.3,61.72 IC3.2 19.81,61.72 | 19.81,60.05 19.81,59.74 16.15,56.08 S4.4 16.15,55.93 17.22,54.86 17.22,48.31 16.46,47.55 16.46,45.41 17.07,44.81 17.07,43.74 C19.2 17.22,43.59 18.75,42.06 18.75,40.39 24.23,34.9 v26.98,34.9 31.24,34.9 32.46,33.68 37.49,33.68 IC2.10 | 19.81,60.05 19.81,61.72 | 19.81,61.72 19.81,61.87 C17.2 19.81,61.72 | 19.81,60.05 v21.49,58.37 | 99.97,36.73 98.91,37.8 C9.2 | 99.97,36.73 103.78,36.73 106.22,39.17 S5.4 | 99.06,27.74 100.13,26.67 C10.2 100.28,26.67 101.8,28.19 114.45,28.19 U$1.3 | 99.06,27.74 96.62,27.74 95.56,26.67 94.94,26.67 IC1.1 94.94,26.52 90.07,26.52 83.36,19.81 81.53,19.81 | 99.97,36.73 99.97,30.02 99.06,29.11 99.06,27.74 | T4.2 117.04,61.27 117.04,60.66 116.28,59.89 116.28,58.37 117.04,57.61 T3.2 117.04,57.45 116.28,56.69 116.28,53.95 117.04,53.19 117.04,52.43 T2.2 117.04,52.27 115.06,52.27 113.84,51.05 | 114.61,38.86 114.61,42.82 T5.2 114.61,42.98 114.61,48.46 T1.2 114.45,48.62 113.84,49.23 113.84,51.05 | 114.61,38.86 113.84,38.1 C6.2 | 114.61,38.86 115.37,38.1 116.74,38.1 C5.2
  Top 0.152: 102.56,41.45 102.56,41.15 C3.2 102.56,41.45 | 102.56,41.45 104.85,43.74 C18.2 | 99.97,42.22 95.86,38.1 94.94,38.1 IC1.10 | 99.97,42.22 101.8,42.22 102.56,41.45 | 99.67,56.69 102.26,56.69 102.56,57 C16.2 102.72,57 103.63,56.08 103.94,56.08 | 99.67,56.69 94.64,56.69 94.49,56.84 94.49,57.76 95.4,58.67 95.4,61.27 T8.2 | 103.94,56.08 106.22,56.08 S3.4 106.38,55.93 106.68,55.93 111.56,51.05 113.84,51.05 | 99.97,42.22 99.97,44.2 99.67,44.5 99.67,56.69 | 103.94,56.08 103.94,49.68 102.56,48.31 102.56,46.33 IC4.2 | C7.2 18.9,29.26 21.03,29.26 C8.2 21.18,29.26 22.55,29.26 26.36,25.45 32.31,25.45 v33.38,24.38 36.58,21.18 | 36.58,21.18 36.58,19.36 C21.2 36.58,19.2 36.73,19.05 S8.2 | 36.58,21.18 37.49,22.1 IC2.1 | S8.2 45.11,22.25 48.01,22.25 S7.4 | X2.5 48.62,8.99 49.07,8.99 51.66,11.58 C13.2 51.82,11.73 51.82,12.8 54.1,15.09 54.1,17.83 55.02,18.75 55.78,18.75 C20.2 55.93,18.9 57,19.96 57,21.18 61.42,25.6 63.25,25.6 IC5.4 63.4,25.45 64.47,25.45 65.99,23.93 66.6,23.93 66.75,23.77 66.75,22.71 66.6,22.55 65.38,22.55 65.23,22.4 65.23,21.64 65.53,21.34 67.82,21.34 68.73,22.25 S1.4 68.89,22.4 70.87,24.38 70.87,25.15 C14.2 | X2.4 47.85,7.77 47.85,8.23 48.46,8.84 X2.5 | v67.21,27.74 68.58,27.74 C11.2 | IC5.15 63.4,32.61 65.08,32.61 65.99,31.7 C12.2 66.14,31.55 v69.8,31.55 | C15.2 80.47,25.6 80.47,23.77 79.1,22.4 S2.4 79.1,22.25 81.53,19.81 | 81.53,19.81 81.53,8.99 X3.5 | S8.2 41.91,18.44 46.02,14.33 46.02,10.82 47.09,9.75 47.7,9.75 48.46,8.99 X2.5
  Bottom 0.152: S6.4 16.15,40.84 17.53,42.22 T15.2 17.53,43.59 15.09,43.59 14.78,43.89 14.78,54.56 16.15,55.93 S4.4 | 28.35,48.77 28.35,49.23 X1.26 28.35,49.38 28.35,49.68 X1.25 | 28.35,48.77 28.35,48.31 X1.28 28.35,48.16 28.35,47.85 X1.29 28.35,47.7 28.35,47.4 X1.30 28.35,47.24 28.35,46.79 X1.31 28.35,46.63 28.35,46.33 X1.32 | 28.35,48.77 X1.27 | T12.2 25.15,46.18 28.19,46.18 X1.32 | T14.2 23.16,40.23 23.93,39.47 23.93,37.95 23.62,37.64 23.16,37.64 22.86,37.34 22.86,36.27 23.01,36.12 23.01,35.36 T13.2 23.16,35.2 24.38,33.98 24.38,33.83 24.69,33.53 25.6,33.53 v26.98,34.9 27.43,35.36 27.43,36.73 | 27.43,36.73 27.43,38.86 28.19,39.62 X1.45 28.35,39.78 28.96,39.78 29.26,40.08 29.26,44.96 28.96,45.26 28.35,45.26 X1.34 28.35,45.41 28.35,45.72 X1.33 28.35,45.87 28.35,46.18 X1.32 | X1.16 28.35,54.41 28.35,54.71 X1.15 28.35,54.86 28.35,55.17 X1.14 28.35,55.32 28.35,55.63 X1.13 28.35,55.78 28.35,56.24 X1.12 28.19,56.39 27.28,56.39 26.21,57.45 26.21,57.91 | X1.1 28.19,61.72 27.43,61.72 27.28,61.57 27.28,60.5 27.43,60.35 28.19,60.35 X1.4 28.35,60.2 28.35,59.89 X1.5 28.35,59.74 28.35,59.28 X1.6 28.19,59.28 27.58,59.28 26.21,57.91 | 26.21,57.91 21.95,57.91 v21.49,58.37 | IC4.2 102.56,46.18 102.56,42.98 106.22,39.32 S5.4 | v67.21,27.74 67.21,23.93 68.73,22.4 S1.4 68.89,22.25 71.17,22.25 73,20.42 74.52,20.42 77.72,23.62 | 77.72,23.62 78.94,22.4 S2.4 | 77.72,23.62 v69.8,31.55 | 27.43,36.73 29.41,36.73 36.42,29.72 36.42,27.43 v33.38,24.38
IO1_0  (via drill 0.38)
  Top 0.152: R28.1 72.54,27.43 72.54,25.3 72.69,25.15 C14.1 72.85,25.15 72.85,22.86 73.3,22.4 S1.2 | v57.3,26.06 57.45,26.21 57.45,27.43 56.84,28.04 55.63,28.04 IC5.31 | v60.81,24.08 61.72,24.08 v62.18,23.62
  Bottom 0.152: v57.3,26.06 58.83,26.06 v60.81,24.08 | v62.18,23.62 67.06,28.5 67.36,28.5 73.46,22.4 S1.2
IO1_1  (via drill 0.38)
  Top 0.152: R29.1 81.99,27.58 81.99,26.21 82.45,25.76 C15.1 82.6,25.6 82.6,23.32 83.52,22.4 S2.2 | v53.65,27.43 55.47,27.43 IC5.32 | v51.05,24.84 51.05,24.23 50.14,23.32 v50.14,17.68 | v54.86,17.68 56.08,17.68 57.15,16.61 67.36,16.61 v70.87,20.12
  Bottom 0.152: v51.05,24.84 v53.65,27.43 | v54.86,17.68 v50.14,17.68 | v70.87,20.12 81.38,20.12 83.52,22.25 S2.2
IO1_2  (via drill 0.38)
  Top 0.152: C16.1 102.56,55.17 102.26,54.86 102.26,52.43 R30.1 102.26,52.27 102.56,52.27 v103.17,51.66 | v56.69,27.28 56.39,26.98 55.63,26.98 IC5.33 | v58.06,28.65 58.06,29.11 58.52,29.57 58.52,37.19 61.11,39.78 91.59,39.78 v94.34,42.52
  Bottom 0.152: v58.06,28.65 v56.69,27.28 | 103.33,51.51 105.92,54.1 108.97,54.1 110.8,55.93 S3.2 | 103.33,51.51 v94.34,42.52 | 103.33,51.51 v103.17,51.66
IO1_3  (via drill 0.38)
  Top 0.152: R31.1 4.57,63.09 6.25,64.77 18.9,64.77 21.64,62.03 C17.1 21.79,61.87 21.79,58.98 22.25,58.52 22.25,57.61 20.73,56.08 | v52.58,27.28 53.49,26.36 55.47,26.36 IC5.34 | v35.81,40.84 34.14,40.84 23.62,51.36 23.62,53.19 20.73,56.08 | 20.73,56.08 S4.2
  Bottom 0.152: v52.58,27.28 48.62,31.24 44.96,31.24 35.81,40.39 v35.81,40.84
IO4_0  (via drill 0.38)
  Top 0.152: v71.78,33.53 71.32,33.98 63.4,33.98 IC5.17 | v93.27,30.33 94.49,29.11 94.94,29.11 IC1.3 | v34.59,26.52 36.27,24.84 37.49,24.84 IC2.3 37.64,24.69 38.1,24.69 39.47,23.32 v39.47,21.64
  Bottom 0.152: v93.27,30.33 74.98,30.33 v71.78,33.53 67.21,33.53 62.33,28.65 62.33,24.69 57.76,20.12 49.68,20.12 48.62,19.05 43.89,19.05 42.37,20.57 40.54,20.57 v39.47,21.64 | v34.59,26.52 32.46,28.65 23.93,28.65 19.66,32.92 19.66,33.38 13.87,39.17 13.87,46.63 12.04,48.46 10.82,48.46 1.07,58.22 1.07,58.52 2.29,59.74 3.96,59.74 5.94,57.76 21.18,57.76 21.34,57.61 22.1,57.61 25.91,53.8 28.19,53.8 X1.17
IO4_1  (via drill 0.38)
  Top 0.152: v72.85,33.53 71.78,34.59 63.4,34.59 IC5.18 63.25,34.59 v61.11,34.59 | v93.27,31.55 94.34,30.48 94.94,30.48 IC1.4 | v34.44,35.05 34.44,38.41 | v35.97,26.06 37.49,26.06 IC2.4 | 34.44,38.41 v38.71,38.41 | 34.44,38.41 v34.44,38.71
  Bottom 0.152: v72.85,33.53 91.29,33.53 v93.27,31.55 | v34.44,38.71 32.77,40.39 32.77,49.68 29.26,53.19 28.35,53.19 X1.18 | v34.44,35.05 34.44,33.68 36.73,31.39 36.73,26.82 v35.97,26.06 | v61.11,34.59 61.11,35.97 61.27,36.12 61.27,36.42 59.28,38.41 v38.71,38.41
IO4_2  (via drill 0.38)
  Top 0.152: v60.05,35.36 63.25,35.36 IC5.19 63.4,35.36 v64.47,35.36 | v46.18,32 44.65,30.48 39.17,30.48 38.56,29.87 37.64,29.87 IC2.7 37.49,29.72 v35.05,29.72 | v21.34,52.88 21.34,51.05 25.6,46.79 25.6,46.02 29.26,42.37 v29.26,35.97 | v86.56,34.29 94.94,34.29 IC1.7
  Bottom 0.152: v60.05,35.36 53.19,35.36 52.73,35.81 49.68,35.81 46.18,32.31 v46.18,32 | v21.34,52.88 22.55,54.1 25.15,54.1 26.36,52.88 28.19,52.88 X1.19 | v29.26,35.97 29.26,35.51 v35.05,29.72 | v86.56,34.29 65.53,34.29 v64.47,35.36
IO4_3  (via drill 0.38)
  Top 0.152: v51.97,33.53 53.65,35.2 55.47,35.2 IC5.20 | v50.75,31.39 47.7,31.39 46.33,32.77 39.62,32.77 38.1,31.24 37.64,31.24 IC2.8 37.49,31.24 v35.97,31.24 | v22.1,51.21 22.1,50.75 25.91,46.94 25.91,46.18 31.24,40.84 v31.24,35.97 | v86.56,35.51 94.94,35.51 IC1.8 | v81.53,40.54 61.42,40.54 57.76,36.88 v57.76,34.59
  Bottom 0.152: 51.97,33.38 51.97,32.61 v50.75,31.39 | v22.1,51.21 22.1,53.19 22.71,53.8 24.99,53.8 26.52,52.27 28.19,52.27 X1.20 | v35.97,31.24 v31.24,35.97 | v81.53,40.54 v86.56,35.51 | v57.76,34.59 54.86,34.59 53.65,33.38 51.97,33.38 | 51.97,33.38 v51.97,33.53
IO4_4  (via drill 0.38)
  Top 0.152: v48.77,35.81 56.24,35.81 56.39,35.66 56.39,35.05 56.08,34.75 55.63,34.75 IC5.21 | v45.11,32 v40.23,32 38.71,30.48 28.19,30.48 27.58,31.09 IC2.13 | v77.11,35.51 84.89,35.51 IC1.13 | v65.53,35.51 65.23,35.51 64.47,36.27 v60.5,36.27
  Bottom 0.152: v45.11,32 45.11,32.16 v48.77,35.81 49.23,36.27 v60.5,36.27 | v40.23,32 32.46,39.78 32.46,49.53 30.33,51.66 28.35,51.66 X1.21 | v65.53,35.51 v77.11,35.51
IO4_5  (via drill 0.38)
  Top 0.152: v53.49,34.14 55.47,34.14 IC5.22 | v52.58,35.05 47.55,35.05 42.82,39.78 33.83,39.78 v30.18,43.43
  Bottom 0.152: v52.58,35.05 v53.49,34.14 | v30.18,43.43 30.18,50.14 30.33,50.29 30.33,50.6 29.72,51.21 28.35,51.21 X1.22
IO4_6  (via drill 0.38)
  Top 0.152: v26.67,46.94 26.67,46.02 33.22,39.47 42.67,39.47 49.38,32.77 53.03,32.77 53.8,33.53 54.1,33.53 54.25,33.38 55.47,33.38 IC5.23
  Bottom 0.152: v26.67,46.94 26.67,49.84 27.58,50.75 28.19,50.75 X1.23
IO4_7  (via drill 0.38)
  Top 0.152: v22.86,53.03 22.86,51.66 34.44,40.08 52.43,40.08 56.69,35.81 56.69,33.38 56.08,32.77 55.63,32.77 IC5.24 | v26.98,51.36 28.65,51.36 v29.57,50.44
  Bottom 0.152: v22.86,53.03 25.3,53.03 v26.98,51.36 | v29.57,50.44 29.11,50.44 28.96,50.29 28.35,50.29 X1.24
J2_1
  Top 0.152: U$3.P$3 104.09,7.92 102.72,7.92 R12.1 102.56,8.08 94.34,8.08 92.81,9.6 K2.3
J2_3
  Top 0.152: K2.10 100.43,9.6 100.74,9.3 102.56,9.3 R12.2 102.72,9.3 104.09,10.67 104.09,17.98 U$3.P$4
J3_1
  Top 0.152: 24.38,9.14 26.21,9.14 26.67,9.6 K3.3 | 24.38,9.14 22.4,11.12 22.4,17.98 U$4.P$3 | 24.38,9.14 R27.1
J3_3
  Top 0.152: 24.38,7.77 22.4,7.77 U$4.P$4 | 24.38,7.77 32.46,7.77 34.29,9.6 K3.10 | 24.38,7.77 R27.2
LD_/C  (via drill 0.38)
  Top 0.152: v50.9,28.04 52.27,29.41 55.47,29.41 IC5.29 | v31.09,56.39 v33.38,56.39
  Bottom 0.152: v50.9,28.04 47.7,28.04 33.98,41.76 33.98,55.78 v33.38,56.39 | v31.09,56.39 30.63,56.39 29.26,57.76 28.35,57.76 X1.9
LEDK1
  Bottom 0.152: R37.2 24.84,44.35 25.45,44.35 26.21,43.59 27.43,43.59 27.58,43.74 28.19,43.74 X1.37
LEDK2
  Bottom 0.152: R38.2 24.84,43.28 28.19,43.28 X1.38
LEDK3
  Bottom 0.152: R39.2 26.67,41.91 27.43,42.67 28.19,42.67 X1.39
LEDK4
  Bottom 0.152: R40.2 24.84,36.88 24.84,37.8 27.28,40.23 27.28,42.06 27.43,42.22 28.19,42.22 X1.40
LHVTRIG  (via drill 0.38)
  Top 0.152: v101.5,29.72 R13.1 | v51.82,19.36 50.44,20.73 50.44,23.16 51.82,24.54 51.82,27.43 53.19,28.8 55.47,28.8 IC5.30
  Bottom 0.152: v101.5,29.72 98.3,29.72 87.94,19.36 v51.82,19.36
LLED  (via drill 0.38)
  Top 0.152: v54.41,30.79 55.47,30.79 IC5.27 | v53.95,32.77 53.49,32.77 53.19,32.46 47.55,32.46 45.72,34.29 32.31,34.29 31.39,35.2 28.04,35.2 22.71,40.54 v22.71,46.02
  Bottom 0.152: R42.1 24.69,51.97 23.62,50.9 23.62,49.53 R41.1 23.47,48.62 21.34,46.48 | 21.34,46.48 21.49,46.48 R43.1 | 21.34,46.48 20.42,46.48 R44.1 | v54.41,30.79 54.41,32.31 v53.95,32.77 | v22.71,46.02 21.95,46.02 21.64,46.33 R43.1 | 21.34,46.48 R43.1
LRD  (via drill 0.38)
  Top 0.152: v58.52,27.74 58.52,28.19 59.89,29.57 63.25,29.57 IC5.10 | v31.7,53.95 v31.7,49.38
  Bottom 0.152: v58.52,27.74 58.06,27.74 54.41,24.08 51.82,24.08 49.07,21.34 49.07,21.03 48.46,20.42 47.24,20.42 37.03,30.63 37.03,34.75 31.7,40.08 v31.7,49.38 | v31.7,53.95 28.96,56.69 28.35,56.69 X1.11
LRESET  (via drill 0.38)
  Top 0.152: v44.65,29.72 49.99,29.72 51.82,31.55 55.47,31.55 IC5.26
  Bottom 0.152: v44.65,29.72 44.65,30.18 33.38,41.45 33.38,55.02 29.72,58.67 28.35,58.67 X1.7
LTS+
  Top 0.152: K2.8 94.03,4.57 92.51,3.05 91.14,3.05 90.22,2.13 X4.1
LTS-
  Top 0.152: K2.5 92.66,4.57 92.66,5.64 90.22,8.08 X4.3
LVSEL
  Top 0.152: IC5.14 63.4,32 63.86,32 65.08,30.79 71.02,30.79 78.18,37.95 84.89,37.95 IC1.11
LWR  (via drill 0.38)
  Top 0.152: v60.05,28.8 63.25,28.8 IC5.9 | v48.01,33.22 47.24,33.22 42.82,37.64 v36.27,37.64
  Bottom 0.152: v60.05,28.8 58.83,28.8 58.22,29.41 51.82,29.41 v48.01,33.22 | v36.27,37.64 36.27,38.1 33.07,41.3 33.07,53.49 29.41,57.15 28.35,57.15 X1.10
N$1  (via drill 0.38)
  Top 0.152: v119.63,42.98 119.63,44.96 119.94,45.26 119.94,47.4 120.09,47.55 120.09,49.23 120.7,49.84 120.7,50.44 R1.1 | v96.62,28.96 95.56,27.89 94.94,27.89 IC1.2
  Bottom 0.152: v119.63,42.98 119.63,41.91 112.17,34.44 102.11,34.44 v96.62,28.96
N$2  (via drill 0.38)
  Top 0.152: v118.72,55.02 121.01,55.02 121.92,54.1 R2.1 | v99.21,35.51 98.45,34.75 98.45,34.59 95.56,31.7 94.94,31.7 IC1.5
  Bottom 0.152: v118.72,55.02 106.98,43.28 105.92,43.28 105.31,42.67 105.31,42.37 106.68,41 106.83,41 107.44,40.39 107.44,38.1 104.85,35.51 v99.21,35.51
N$3  (via drill 0.38)
  Top 0.152: v122.07,46.33 124.05,48.31 124.05,57.3 123.44,57.91 123.44,58.83 R3.1 | v97.69,34.75 95.86,32.92 94.94,32.92 IC1.6
  Bottom 0.152: v122.07,46.33 118.42,42.67 118.42,41.15 112.01,34.75 v97.69,34.75
N$4
  Top 0.152: R4.1 122.99,63.86 122.38,64.47 95.56,64.47 94.18,63.09 94.18,43.59 95.1,42.67 95.1,39.93 93.57,38.41 93.57,37.64 94.49,36.73 94.94,36.73 IC1.9
N$5
  Top 0.152: R5.1 109.73,42.06 106.53,42.06 103.63,39.17 97.99,39.17 96.32,37.49 96.32,36.27 96.16,36.12 86.87,36.12 86.41,36.58 84.89,36.58 IC1.12
N$6
  Top 0.152: 100.58,62.18 97.54,62.18 T8.1 | 100.58,62.18 105.46,62.18 SG1.- | 100.58,62.18 L3.2
N$7
  Top 0.152: T4.3 117.2,63.25 121.31,63.25 121.77,63.7 R4.2
N$8  (via drill 0.38)
  Top 0.152: v115.67,43.74 116.43,42.98 T5.3 | v112.78,43.74 111.25,42.22 R5.2
  Bottom 0.152: v112.78,43.74 v115.67,43.74
N$9
  Top 0.152: 121.01,29.72 D2.A | 121.01,29.72 121.77,30.48 U$1.4 121.01,29.72 | 121.01,29.72 121.01,19.96 124.36,16.61 124.36,7.92 U$3.P$1
N$10
  Top 0.152: T1.1 116.59,49.53 118.72,49.53 R7.1
N$11
  Top 0.152: T2.1 119.18,53.34 119.79,53.34 120.7,52.43 R8.1
N$12
  Top 0.152: T3.1 119.18,58.37 120.55,58.37 121.92,57 R9.1
N$13
  Top 0.152: T1.3 114.61,50.6 119.48,50.6 R1.2
N$14
  Top 0.152: T2.3 117.2,54.25 120.55,54.25 120.7,54.1 R2.2
N$15
  Top 0.152: T3.3 117.2,59.28 121.61,59.28 121.92,58.98 R3.2
N$16
  Top 0.152: T4.1 119.18,62.18 121.61,62.18 121.77,62.03 R10.1
N$17
  Top 0.152: 120.85,48.77 120.85,46.48 C1.2 120.7,46.48 120.4,46.18 120.4,44.5 R11.2 120.4,44.35 120.4,41.3 IC7.7 | 120.85,48.77 121.92,49.84 121.92,52.27 R8.2 122.07,52.43 123.29,53.65 123.29,56.84 R9.2 123.29,57 122.68,57.61 122.68,59.44 122.99,59.74 122.99,61.87 R10.2 | 120.85,48.77 R7.2
N$18
  Top 0.152: C1.1 119.02,46.48 119.02,44.5 R11.1 118.87,44.35 118.87,44.04 116.43,41.6 115.06,41.6 114.91,41.45 114.91,40.39 116.28,39.01 117.65,39.01 117.96,38.71 117.96,37.34 | D2.C 109.88,29.72 110.8,30.63 114.15,30.63 116.74,33.22 116.74,36.12 | 116.74,36.12 113.84,36.12 C6.1 | 116.74,36.12 C5.1 116.89,36.27 117.96,37.34 | 117.96,37.34 119.18,36.12 IC7.1 119.33,35.97 119.33,35.36 120.09,34.59 123.9,34.59 125.27,33.22 125.27,27.74 124.51,26.98 124.51,18.14 U$3.P$2
N$19
  Top 0.152: 6.1,29.57 16,29.57 D1.A | 6.1,29.57 5.18,30.48 U$2.4 6.1,29.57 | 6.1,29.57 2.13,25.6 2.13,18.14 U$4.P$1
N$20
  Top 0.152: R15.1 13.72,57 13.11,57.61 6.4,57.61 4.72,55.93 3.96,55.93 3.2,55.17 3.2,53.49 0.61,50.9 0.61,40.39 3.66,37.34 5.64,37.34 5.94,37.03 5.94,34.75 7.16,33.53 9.6,33.53 12.95,30.18 22.86,30.18 26.36,26.67 33.53,26.67 36.58,23.62 37.49,23.62 IC2.2
N$21
  Top 0.152: R13.2 107.44,29.72 108.66,30.94 112.78,30.94 114.45,32.61 U$1.1
N$22
  Top 0.152: T8.3 95.56,63.09 95.56,62.48 96.32,61.72 96.32,58.37 95.25,57.3 R14.2
N$23
  Top 0.152: S8.1 41.91,10.97 R35.1
N$24  (via drill 0.38)
  Top 0.152: v19.05,59.89 17.83,58.67 16.61,58.67 15.09,57.15 15.09,54.71 13.87,53.49 13.87,52.12 R16.1 | v45.41,23.16 42.82,20.57 41,20.57 40.23,21.34 40.23,25.15 38.1,27.28 37.64,27.28 IC2.5
  Bottom 0.152: v19.05,59.89 21.34,59.89 23.93,62.48 29.26,62.48 32.61,59.13 32.61,56.24 33.68,55.17 33.68,41.6 45.41,29.87 v45.41,23.16
N$25  (via drill 0.38)
  Top 0.152: v11.89,47.7 12.5,48.31 13.26,48.31 14.02,47.55 R17.1 | v32.31,27.89 34.59,27.89 34.9,28.19 37.19,28.19 37.49,28.5 IC2.6
  Bottom 0.152: v11.89,47.7 11.89,40.69 19.36,33.22 19.36,32.77 29.26,22.86 29.57,22.86 32.31,25.6 v32.31,27.89
N$26
  Top 0.152: R18.1 15.54,43.43 16.46,42.52 16.61,42.52 18.44,40.69 18.44,40.23 25.6,33.07 32.16,33.07 32.77,32.46 37.49,32.46 IC2.9
N$27
  Top 0.152: R19.1 24.54,32.46 27.43,32.46 IC2.12
N$28
  Bottom 0.152: T13.3 23.01,33.38 23.01,34.14 22.1,35.05 22.1,43.28 20.42,44.96 R44.2
N$29
  Top 0.152: T6.3 7.92,57 12.5,57 R15.2
N$30
  Top 0.152: T7.3 7.92,51.82 12.34,51.82 12.5,51.97 R16.2
N$31
  Top 0.152: T9.3 7.92,46.79 12.19,46.79 12.8,47.4 R17.2
N$32
  Top 0.152: T10.3 9.14,41.76 10.82,41.76 12.5,43.43 R18.2
N$33
  Top 0.152: T11.3 20.57,36.58 23.16,33.98 23.16,32.61 R19.2
N$34
  Top 0.152: R35.2 40.39,10.97 30.33,10.97 26.67,14.63 K3.1
  Bottom 0.152: K2.1 92.66,14.63 84.58,14.63 83.36,13.41 27.89,13.41 26.67,14.63 K3.1
N$35
  Top 0.152: T6.1 9.91,55.78 11.89,55.78 12.5,55.17 R22.1
N$36
  Top 0.152: T7.1 9.91,50.75 12.04,50.75 12.5,50.29 R23.1
N$37
  Top 0.152: T9.1 9.91,45.87 12.8,45.87 R24.1
N$38
  Top 0.152: T10.1 11.28,40.54 13.72,40.54 R25.1
N$39
  Top 0.152: R26.2 2.29,44.2 4.27,44.2 4.57,43.89 C2.2 4.57,43.74 | 4.57,43.74 4.57,41.91 3.96,41.3 IC8.7 | R25.2 13.72,42.37 13.26,42.82 13.26,44.2 | 13.26,44.2 13.26,45.11 14.02,45.87 R24.2 14.17,46.02 14.78,46.63 14.78,48.01 13.87,48.92 R23.2 13.72,50.29 13.26,50.75 13.26,53.34 13.72,53.8 13.72,55.02 R22.2 | 4.57,43.74 11.73,43.74 12.19,44.2 13.26,44.2
N$40  (via drill 0.38)
  Top 0.152: 16,31.85 18.14,31.85 18.75,31.24 C7.1 18.9,31.24 21.03,31.24 C8.1 | C2.1 4.57,45.72 2.29,45.72 R26.1 2.29,45.57 1.83,45.57 1.22,44.96 1.22,41.15 v1.68,40.69 | v1.68,37.03 2.59,36.12 IC8.1 2.59,35.97 1.22,34.59 1.22,17.37 1.98,16.61 1.98,7.92 U$4.P$2 | 16,31.85 12.5,31.85 v12.34,31.7 | 16,31.85 D1.C
  Bottom 0.152: v1.68,40.69 v1.68,37.03 7.01,31.7 v12.34,31.7
N$41
  Bottom 0.152: T12.1 23.16,46.94 23.16,46.48 23.47,46.18 23.47,44.5 R37.1
N$42  (via drill 0.38)
  Top 0.152: v71.02,17.68 74.37,21.03 74.37,26.82 73,28.19 70.87,28.19 69.95,27.28 69.95,25.3 69.49,24.84 69.19,24.84 67.82,23.47 67.82,23.32 66.6,22.1 66.14,22.1 R21.2 | v15.39,27.43 13.26,27.43 12.5,28.19 U$2.1
  Bottom 0.152: v71.02,17.68 58.52,17.68 54.56,13.72 29.11,13.72 v15.39,27.43
N$43
  Bottom 0.152: T15.1 15.54,44.5 18.59,44.5 19.81,45.72 22.1,45.72 22.86,44.96 22.86,43.89 23.47,43.28 R38.1
N$44
  Bottom 0.152: T14.1 25.15,40.39 23.62,41.91 R39.1
N$45
  Top 0.152: T5.1 115.67,40.84 117.2,40.84 120.7,37.34 122.22,37.34 122.99,36.58 122.99,36.12 IC7.4
N$46
  Bottom 0.152: T13.1 25.15,35.2 23.62,36.73 R40.1
N$47
  Top 0.152: T11.1 10.06,34.59 7.92,34.59 6.55,35.97 IC8.4
N$48
  Bottom 0.152: T14.3 23.01,38.41 23.01,39.17 22.4,39.78 22.4,44.2 21.64,44.96 R43.2
N$49
  Bottom 0.152: T12.3 25.15,49.23 24.84,49.53 R41.2
N$50
  Bottom 0.152: T15.3 17.53,45.57 18.29,45.57 20.42,47.7 21.18,47.7 22.86,49.38 22.86,51.36 23.47,51.97 R42.2
RHVTRIG
  Top 0.152: R21.1 65.99,23.32 65.38,23.32 63.86,24.84 63.4,24.84 IC5.3
RTS+
  Top 0.152: K3.8 38.1,4.57 40.54,2.13 X5.1
RTS-
  Top 0.152: K3.5 32.92,4.57 35.81,7.47 39.93,7.47 40.54,8.08 X5.3
RVSEL
  Top 0.152: IC5.25 55.47,32 51.05,32 50.9,32.16 47.4,32.16 46.48,33.07 32.61,33.07 32.16,33.53 27.58,33.53 IC2.11
SCL  (via drill 0.38)
  Top 0.152: v64.62,30.02 64.62,30.48 63.7,31.39 63.4,31.39 IC5.13 | 75.59,10.52 v75.59,22.4 | 75.59,10.52 78.33,7.77 79.1,7.77 X3.2 | 75.59,10.52 71.93,6.86 47.4,6.86 46.63,7.62 46.33,7.62 X2.2
  Bottom 0.152: v64.62,30.02 67.97,30.02 v75.59,22.4
SDA
  Top 0.152: IC5.12 63.25,30.79 62.79,30.79 59.28,34.29 59.28,35.97 61.87,38.56 86.11,38.56 86.26,38.41 86.26,37.64 85.95,37.34 78.03,37.34 76.35,35.66 76.35,12.65 80.01,8.99 X3.3
  Bottom 0.152: X2.3 47.09,8.99 47.4,8.99 48.16,9.75 79.25,9.75 80.01,8.99 X3.3
SPKR  (via drill 0.38)
  Top 0.152: R14.1 95.25,42.98 95.86,42.37 v95.86,40.84 | v60.5,32.16 60.81,32.16 62.79,30.18 63.25,30.18 IC5.11
  Bottom 0.152: v95.86,40.84 82.14,40.84 81.69,41.3 69.49,41.3 60.5,32.31 v60.5,32.16
TCK  (via drill 0.38)
  Top 0.152: R32.1 102.41,50.44 102.41,48.62 101.5,47.7 101.5,45.87 102.11,45.26 104.55,45.26 104.85,45.57 C18.1 105,45.57 107.59,45.57 110.49,42.67 110.49,41.6 110.8,41.3 110.8,39.32 S5.2 110.8,39.17 110.03,39.17 v99.82,28.96 | v1.52,59.89 2.44,58.98 TP4.TP | v46.63,20.12 v44.65,18.14 | v51.21,22.55 51.21,23.16 53.65,25.6 55.47,25.6 IC5.35
  Bottom 0.152: v1.52,59.89 1.52,59.44 0.76,58.67 0.76,45.41 17.68,28.5 22.71,28.5 33.07,18.14 v44.65,18.14 44.96,18.44 87.48,18.44 97.99,28.96 v99.82,28.96 | v46.63,20.12 48.77,20.12 v51.21,22.55
TDI  (via drill 0.38)
  Top 0.152: v58.06,21.34 58.98,20.42 R34.1 | v56.39,22.1 55.93,21.64 55.93,20.88 C20.1 | v3.5,61.11 3.2,61.42 2.59,61.42 TP2.TP | v23.01,62.48 30.94,54.56 30.94,45.87 33.98,42.82 33.98,41.76 34.14,41.6 51.36,41.6 57,35.97 57,31.39 58.06,30.33 58.06,29.57 57.3,28.8 57.3,28.04 58.06,27.28 58.06,25.91 56.54,24.38 55.63,24.38 IC5.37 55.47,24.23 55.17,24.23 53.34,22.4 52.58,22.4 S7.2
  Bottom 0.152: 56.39,21.34 53.49,21.34 52.58,22.25 S7.2 | 56.39,21.34 v58.06,21.34 | 56.39,21.34 v56.39,22.1 | v3.5,61.11 21.64,61.11 v23.01,62.48
TDO  (via drill 0.38)
  Top 0.152: R36.1 26.67,19.51 27.43,18.75 34.14,18.75 34.59,19.2 C21.1 34.75,19.36 34.75,19.66 v35.81,20.73 | v1.83,58.37 0.76,59.44 0.76,60.5 2.44,62.18 2.44,62.64 TP1.TP | v19.36,34.59 19.36,33.22 20.42,32.16 22.1,32.16 26.36,27.89 30.02,27.89 30.79,27.13 34.29,27.13 35.05,27.89 38.71,27.89 40.84,25.76 40.84,22.71 41.91,21.64 S8.3 | v51.21,20.88 51.66,20.42 52.88,20.42 55.47,23.01 55.47,23.47 IC5.38
  Bottom 0.152: v1.83,58.37 2.59,58.37 14.17,46.79 14.17,39.78 v19.36,34.59 | v51.21,20.88 49.99,20.88 48.46,19.36 44.04,19.36 41.91,21.49 S8.3 41.91,21.64 41.15,22.4 39.32,22.4 37.64,20.73 v35.81,20.73
TEST  (via drill 0.38)
  Top 0.152: 2.59,56.39 3.96,56.39 4.72,57.15 R20.1 | v57.3,17.37 59.74,19.81 59.74,20.88 59.89,21.03 60.5,21.03 62.94,23.47 63.25,23.47 IC5.1 | v8.08,39.01 v8.08,37.19 | 2.59,56.39 v2.59,55.47 | 2.59,56.39 TP6.TP
  Bottom 0.152: v57.3,17.37 56.39,17.37 53.03,14.02 36.42,14.02 22.25,28.19 17.07,28.19 v8.08,37.19 | v8.08,39.01 8.08,49.99 v2.59,55.47
TMS  (via drill 0.38)
  Top 0.152: R33.1 18.44,45.87 18.44,44.2 18.9,43.74 C19.1 19.05,43.59 19.05,42.37 20.57,40.84 S6.2 | v3.81,58.98 2.59,60.2 TP3.TP | v53.8,24.84 55.47,24.84 IC5.36 | v46.18,25.91 41.91,25.91 38.56,29.26 35.97,29.26 v35.66,28.96
  Bottom 0.152: v3.81,58.98 3.81,57.61 14.48,46.94 14.48,40.08 15.7,38.86 18.75,38.86 | 18.75,38.86 20.57,40.69 S6.2 | v53.8,24.84 51.97,24.84 51.21,24.08 48.01,24.08 v46.18,25.91 | v35.66,28.96 26.21,28.96 21.79,33.38 21.79,35.81 18.75,38.86
VBAT  (2 unrouted)
VCC  (via drill 0.38)
  Top 0.152: L3.1 100.58,59.89 109.58,59.89 111.86,62.18 SG1.+ | K2.12 98.45,16.61 98.45,26.67 C10.1 | 45.41,10.21 45.41,8.99 X2.1 | 45.41,10.21 45.41,11.43 | v13.11,63.86 16.61,63.86 IC3.3 | 45.41,10.21 41.3,10.21 41.15,10.36 41.15,11.43 37.95,14.63 34.29,14.63 K3.12
  Bottom 0.152: 78.33,7.32 78.33,8.84 X3.1 | 78.33,7.32 80.01,5.64 96.77,5.64 | 96.77,5.64 100.28,2.13 K2.7 | 96.77,5.64 96.77,7.47 100.28,10.97 100.28,14.63 K2.12 100.43,14.78 100.43,15.85 122.83,38.25 122.83,51.82 112.47,62.18 112.01,62.18 SG1.+ | 45.26,8.84 43.89,8.84 37.19,2.13 34.29,2.13 K3.7 | v13.11,63.86 4.57,63.86 0.46,59.74 0.46,37.34 9.6,28.19 16.61,28.19 30.02,14.78 34.29,14.78 K3.12 | 78.33,7.32 48.62,7.32 48.16,6.86 45.87,6.86 45.26,7.47 45.26,8.84 | 45.26,8.84 X2.1
XIN
  Top 0.152: IC5.6 63.4,26.98 65.99,26.98 Q3.2 66.14,27.13 66.14,29.72 C12.1
XOUT
  Top 0.152: IC5.5 63.4,26.21 65.23,26.21 65.99,25.45 Q3.1 66.14,25.45 66.29,25.6 68.58,25.6 C11.1
(copper drawn outside any net)
  shapes: Bottom area x1, Top area x1

### Text on the board
DrillLegend: LAYER-STACK
DrillLegend_01-16: 01-16
DrillLegend_01-20: 01-20